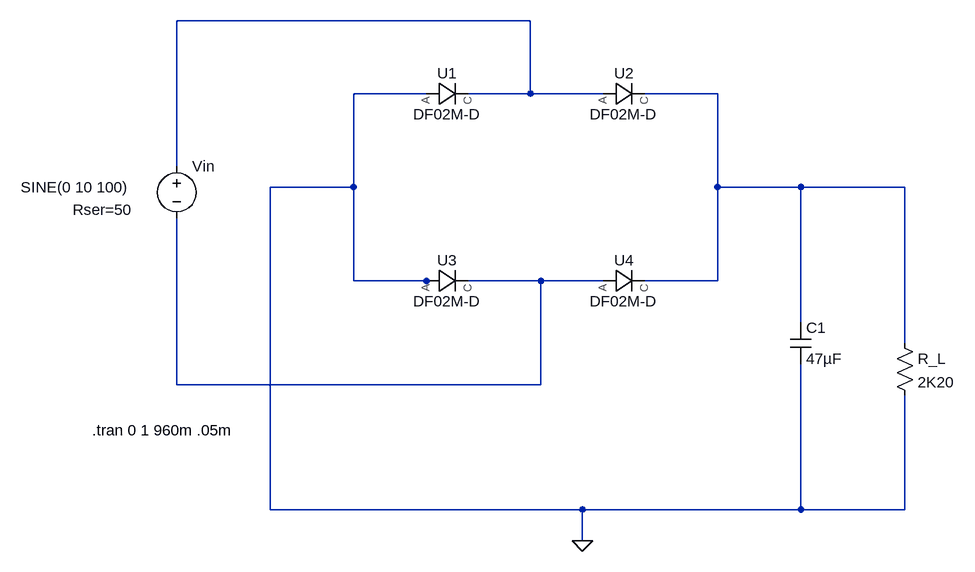
[diagram p0: schematic fullwave_rectifier.asc]
fullwave_rectifier.asc, the LTspice schematic file:
Version 4
SHEET 1 1076 820
WIRE 416 0 -128 0
WIRE 256 112 144 112
WIRE 416 112 416 0
WIRE 416 112 320 112
WIRE 528 112 416 112
WIRE 704 112 592 112
WIRE -128 224 -128 0
WIRE 144 256 144 112
WIRE 144 256 16 256
WIRE 704 256 704 112
WIRE 832 256 704 256
WIRE 992 256 832 256
WIRE 144 400 144 256
WIRE 256 400 144 400
WIRE 272 400 256 400
WIRE 432 400 320 400
WIRE 528 400 432 400
WIRE 704 400 704 256
WIRE 704 400 592 400
WIRE 832 464 832 256
WIRE 992 496 992 256
WIRE -128 560 -128 304
WIRE 432 560 432 400
WIRE 432 560 -128 560
WIRE 16 752 16 256
WIRE 496 752 16 752
WIRE 832 752 832 528
WIRE 832 752 496 752
WIRE 992 752 992 576
WIRE 992 752 832 752
WIRE 496 800 496 752
FLAG 496 800 0
SYMBOL advee_components\\DF02M-D 256 128 R270
WINDOW 3 0 32 VBottom 2
WINDOW 0 32 32 VTop 2
SYMATTR InstName U1
SYMBOL advee_components\\DF02M-D 528 128 R270
WINDOW 3 0 32 VBottom 2
WINDOW 0 32 32 VTop 2
SYMATTR InstName U2
SYMBOL advee_components\\DF02M-D 256 416 R270
WINDOW 3 0 32 VBottom 2
WINDOW 0 32 32 VTop 2
SYMATTR InstName U3
SYMBOL advee_components\\DF02M-D 528 416 R270
WINDOW 3 0 32 VBottom 2
WINDOW 0 32 32 VTop 2
SYMATTR InstName U4
SYMBOL voltage -128 208 R0
WINDOW 3 -240 48 Left 2
WINDOW 123 0 0 Left 0
WINDOW 39 -160 83 Left 2
SYMATTR InstName Vin
SYMATTR Value SINE(0 10 100)
SYMATTR SpiceLine Rser=50
SYMBOL res 976 480 R0
SYMATTR InstName R_L
SYMATTR Value 2K20
SYMBOL cap 816 464 R0
SYMATTR InstName C1
SYMATTR Value 47µF
TEXT -258 630 Left 2 !.tran 0 1 960m .05m

The netlist it stands for:
* fullwave_rectifier.asc
XU1 0 N001 DF02M-D  ; pins A C
XU2 N001 N002 DF02M-D  ; pins A C
XU3 0 N003 DF02M-D  ; pins A C
XU4 N003 N002 DF02M-D  ; pins A C
Vin N001 N003 SINE(0 10 100) Rser=50
R_L N002 0 2K20
C1 N002 0 47µF
.tran 0 1 960m .05m
.lib AdvEE_Components.lib
.backanno
.end